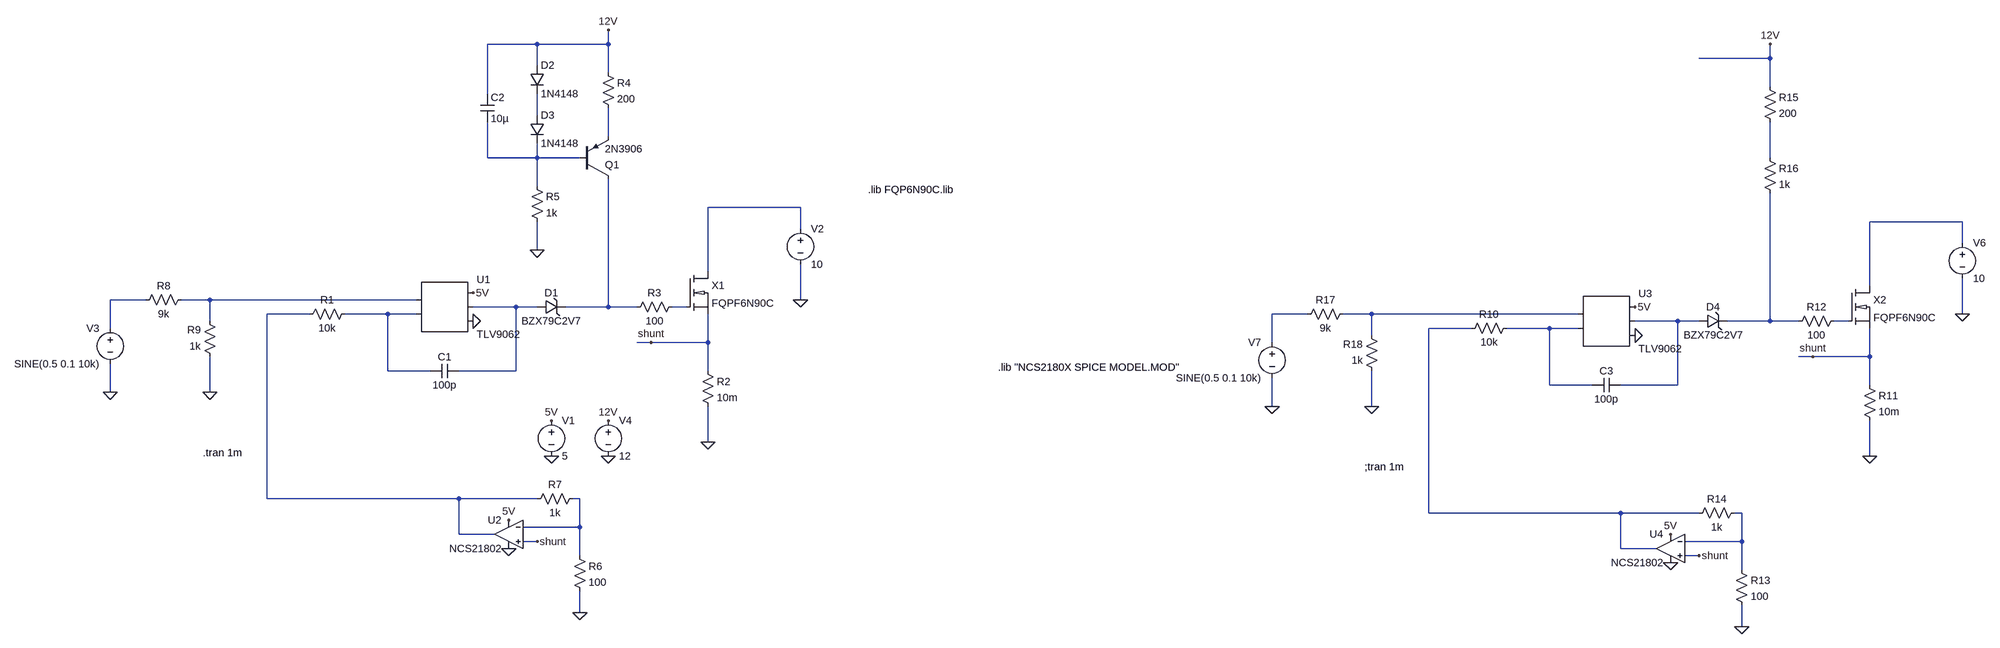
[diagram p0: schematic zener_gate_drive_amp.asc]
zener_gate_drive_amp.asc, the LTspice schematic file:
Version 4
SHEET 1 3992 916
WIRE 448 -416 336 -416
WIRE 608 -416 608 -448
WIRE 608 -416 448 -416
WIRE 3504 -384 3504 -416
WIRE 3504 -384 3344 -384
WIRE 448 -368 448 -416
WIRE 608 -352 608 -416
WIRE 3504 -320 3504 -384
WIRE 336 -304 336 -416
WIRE 448 -256 448 -304
WIRE 608 -208 608 -272
WIRE 336 -160 336 -240
WIRE 448 -160 448 -192
WIRE 448 -160 336 -160
WIRE 544 -160 448 -160
WIRE 3504 -160 3504 -240
WIRE 448 -96 448 -160
WIRE 1040 -48 832 -48
WIRE 3936 -16 3728 -16
WIRE 1040 0 1040 -48
WIRE 3936 32 3936 -16
WIRE 448 48 448 -16
WIRE 832 96 832 -48
WIRE 3728 128 3728 -16
WIRE -432 160 -512 160
WIRE -288 160 -352 160
WIRE 176 160 -288 160
WIRE 1040 160 1040 80
WIRE 400 176 304 176
WIRE 448 176 400 176
WIRE 608 176 608 -112
WIRE 608 176 512 176
WIRE 672 176 608 176
WIRE 784 176 752 176
WIRE -64 192 -160 192
WIRE 112 192 16 192
WIRE 176 192 112 192
WIRE 2464 192 2384 192
WIRE 2608 192 2544 192
WIRE 3072 192 2608 192
WIRE 3936 192 3936 112
WIRE -288 208 -288 160
WIRE 3296 208 3200 208
WIRE 3344 208 3296 208
WIRE 3504 208 3504 -80
WIRE 3504 208 3408 208
WIRE 3568 208 3504 208
WIRE 3680 208 3648 208
WIRE -512 224 -512 160
WIRE 2832 224 2736 224
WIRE 3008 224 2912 224
WIRE 3072 224 3008 224
WIRE 2608 240 2608 192
WIRE 704 256 672 256
WIRE 832 256 832 192
WIRE 832 256 704 256
WIRE 2384 256 2384 192
WIRE 3600 288 3568 288
WIRE 3728 288 3728 224
WIRE 3728 288 3600 288
WIRE 112 320 112 192
WIRE 208 320 112 320
WIRE 400 320 400 176
WIRE 400 320 272 320
WIRE 832 320 832 256
WIRE 3008 352 3008 224
WIRE 3104 352 3008 352
WIRE 3296 352 3296 208
WIRE 3296 352 3168 352
WIRE 3728 352 3728 288
WIRE -512 368 -512 304
WIRE -288 368 -288 288
WIRE 2384 400 2384 336
WIRE 2608 400 2608 320
WIRE 832 480 832 400
WIRE 3728 512 3728 432
WIRE -160 608 -160 192
WIRE 272 608 -160 608
WIRE 448 608 272 608
WIRE 544 608 528 608
WIRE 2736 640 2736 224
WIRE 3168 640 2736 640
WIRE 3344 640 3168 640
WIRE 3440 640 3424 640
WIRE 544 672 544 608
WIRE 544 672 416 672
WIRE 272 688 272 608
WIRE 352 688 272 688
WIRE 448 704 416 704
WIRE 3440 704 3440 640
WIRE 3440 704 3312 704
WIRE 3168 720 3168 640
WIRE 3248 720 3168 720
WIRE 544 736 544 672
WIRE 3344 736 3312 736
WIRE 3440 768 3440 704
WIRE 544 864 544 816
WIRE 3440 896 3440 848
FLAG 304 208 0
FLAG 304 144 5V
FLAG 480 432 5V
FLAG 480 512 0
FLAG 832 480 0
FLAG 1040 160 0
FLAG 704 256 shunt
FLAG -512 368 0
FLAG 608 432 12V
FLAG 608 512 0
FLAG 608 -448 12V
FLAG 448 704 shunt
FLAG 544 864 0
FLAG 384 720 0
FLAG 384 656 5V
FLAG 448 48 0
FLAG -288 368 0
FLAG 3200 240 0
FLAG 3200 176 5V
FLAG 3728 512 0
FLAG 3936 192 0
FLAG 3600 288 shunt
FLAG 2384 400 0
FLAG 3504 -416 12V
FLAG 3344 736 shunt
FLAG 3440 896 0
FLAG 3280 752 0
FLAG 3280 688 5V
FLAG 2608 400 0
SYMBOL AutoGenerated\\TLV9062 240 176 R0
SYMATTR InstName U1
SYMBOL voltage 480 416 R0
WINDOW 123 0 0 Left 0
WINDOW 39 0 0 Left 0
SYMATTR InstName V1
SYMATTR Value 5
SYMBOL res 32 176 R90
WINDOW 0 0 56 VBottom 2
WINDOW 3 32 56 VTop 2
SYMATTR InstName R1
SYMATTR Value 10k
SYMBOL cap 272 304 R90
WINDOW 0 0 32 VBottom 2
WINDOW 3 32 32 VTop 2
SYMATTR InstName C1
SYMATTR Value 100p
SYMBOL res 816 304 R0
SYMATTR InstName R2
SYMATTR Value 10m
SYMBOL voltage 1040 -16 R0
WINDOW 123 0 0 Left 0
WINDOW 39 0 0 Left 0
SYMATTR InstName V2
SYMATTR Value 10
SYMBOL voltage -512 208 M0
WINDOW 123 0 0 Left 0
WINDOW 39 0 0 Left 0
SYMATTR InstName V3
SYMATTR Value SINE(0.5 0.1 10k)
SYMBOL n_channel_mosfet 784 96 R0
SYMATTR InstName X1
SYMBOL res 768 160 R90
WINDOW 0 0 56 VBottom 2
WINDOW 3 32 56 VTop 2
SYMATTR InstName R3
SYMATTR Value 100
SYMBOL voltage 608 416 R0
WINDOW 123 0 0 Left 0
WINDOW 39 0 0 Left 0
SYMATTR InstName V4
SYMATTR Value 12
SYMBOL zener 448 192 R270
WINDOW 0 32 32 VTop 2
WINDOW 3 0 32 VBottom 2
SYMATTR InstName D1
SYMATTR Value BZX79C2V7
SYMATTR Description Diode
SYMATTR Type diode
SYMBOL OpAmps\\opamp2 384 624 M0
SYMATTR InstName U2
SYMATTR Value NCS21802
SYMBOL res 528 720 R0
SYMATTR InstName R6
SYMATTR Value 100
SYMBOL res 544 592 R90
WINDOW 0 0 56 VBottom 2
WINDOW 3 32 56 VTop 2
SYMATTR InstName R7
SYMATTR Value 1k
SYMBOL pnp 544 -112 M180
SYMATTR InstName Q1
SYMATTR Value 2N3906
SYMBOL res 592 -368 R0
SYMATTR InstName R4
SYMATTR Value 200
SYMBOL diode 432 -368 R0
SYMATTR InstName D2
SYMATTR Value 1N4148
SYMBOL diode 432 -256 R0
SYMATTR InstName D3
SYMATTR Value 1N4148
SYMBOL cap 320 -304 R0
SYMATTR InstName C2
SYMATTR Value 10µ
SYMBOL res 432 -112 R0
SYMATTR InstName R5
SYMATTR Value 1k
SYMBOL res -336 144 R90
WINDOW 0 0 56 VBottom 2
WINDOW 3 32 56 VTop 2
SYMATTR InstName R8
SYMATTR Value 9k
SYMBOL res -272 304 R180
WINDOW 0 36 76 Left 2
WINDOW 3 36 40 Left 2
SYMATTR InstName R9
SYMATTR Value 1k
SYMBOL AutoGenerated\\TLV9062 3136 208 R0
SYMATTR InstName U3
SYMBOL res 2928 208 R90
WINDOW 0 0 56 VBottom 2
WINDOW 3 32 56 VTop 2
SYMATTR InstName R10
SYMATTR Value 10k
SYMBOL cap 3168 336 R90
WINDOW 0 0 32 VBottom 2
WINDOW 3 32 32 VTop 2
SYMATTR InstName C3
SYMATTR Value 100p
SYMBOL res 3712 336 R0
SYMATTR InstName R11
SYMATTR Value 10m
SYMBOL voltage 3936 16 R0
WINDOW 123 0 0 Left 0
WINDOW 39 0 0 Left 0
SYMATTR InstName V6
SYMATTR Value 10
SYMBOL voltage 2384 240 M0
WINDOW 123 0 0 Left 0
WINDOW 39 0 0 Left 0
SYMATTR InstName V7
SYMATTR Value SINE(0.5 0.1 10k)
SYMBOL n_channel_mosfet 3680 128 R0
SYMATTR InstName X2
SYMBOL res 3664 192 R90
WINDOW 0 0 56 VBottom 2
WINDOW 3 32 56 VTop 2
SYMATTR InstName R12
SYMATTR Value 100
SYMBOL zener 3344 224 R270
WINDOW 0 32 32 VTop 2
WINDOW 3 0 32 VBottom 2
SYMATTR InstName D4
SYMATTR Value BZX79C2V7
SYMATTR Description Diode
SYMATTR Type diode
SYMBOL OpAmps\\opamp2 3280 656 M0
SYMATTR InstName U4
SYMATTR Value NCS21802
SYMBOL res 3424 752 R0
SYMATTR InstName R13
SYMATTR Value 100
SYMBOL res 3440 624 R90
WINDOW 0 0 56 VBottom 2
WINDOW 3 32 56 VTop 2
SYMATTR InstName R14
SYMATTR Value 1k
SYMBOL res 3488 -336 R0
SYMATTR InstName R15
SYMATTR Value 200
SYMBOL res 3488 -176 R0
SYMATTR InstName R16
SYMATTR Value 1k
SYMBOL res 2560 176 R90
WINDOW 0 0 56 VBottom 2
WINDOW 3 32 56 VTop 2
SYMATTR InstName R17
SYMATTR Value 9k
SYMBOL res 2624 336 R180
WINDOW 0 36 76 Left 2
WINDOW 3 36 40 Left 2
SYMATTR InstName R18
SYMATTR Value 1k
TEXT -304 504 Left 2 !.tran 1m
TEXT 1192 -88 Left 2 !.lib FQP6N90C.lib
TEXT 1768 312 Left 2 !.lib "NCS2180X SPICE MODEL.MOD"
TEXT 2592 536 Left 2 !;tran 1m

The netlist it stands for:
* zener_gate_drive_amp.asc
* U1: TLV9062 (symbol AutoGenerated\TLV9062 not available, pins judged from their places): pin1=N008 pin2=N013 pin3=5V pin4=N009 pin5=0
V1 5V 0 5
R1 N013 N012 10k
C1 N009 N013 100p
R2 shunt 0 10m
V2 N005 0 10
V3 N007 0 SINE(0.5 0.1 10k)
XX1 N005 N011 shunt FQPF6N90C  ; pins D G S
R3 N011 N010 100
V4 12V 0 12
D1 N009 N010 BZX79C2V7
XU2 shunt N021 5V 0 N012 NCS21802  ; pins In+ In- V+ V- OUT
R6 N021 0 100
R7 N021 N012 1k
Q1 N010 N003 N002 0 2N3906
R4 12V N002 200
D2 12V N001 1N4148
D3 N001 N003 1N4148
C2 12V N003 10µ
R5 N003 0 1k
R8 N008 N007 9k
R9 0 N008 1k
* U3: TLV9062 (symbol AutoGenerated\TLV9062 not available, pins judged from their places): pin1=N015 pin2=N020 pin3=5V pin4=N016 pin5=0
R10 N020 N019 10k
C3 N016 N020 100p
R11 shunt 0 10m
V6 N006 0 10
V7 N014 0 SINE(0.5 0.1 10k)
XX2 N006 N018 shunt FQPF6N90C  ; pins D G S
R12 N018 N017 100
D4 N016 N017 BZX79C2V7
XU4 shunt N022 5V 0 N019 NCS21802  ; pins In+ In- V+ V- OUT
R13 N022 0 100
R14 N022 N019 1k
R15 12V N004 200
R16 N004 N017 1k
R17 N015 N014 9k
R18 0 N015 1k
.model D D
.lib standard.dio
.model NPN NPN
.model PNP PNP
.lib standard.bjt
.tran 1m
.lib FQP6N90C.lib
.lib "NCS2180X SPICE MODEL.MOD"
;tran 1m
.lib FQP6N90C.lib
.backanno
.end